# EAGLE design ARE_adaptadora_dsPIC30F4011_44qfn (EAGLE 6.5.0)
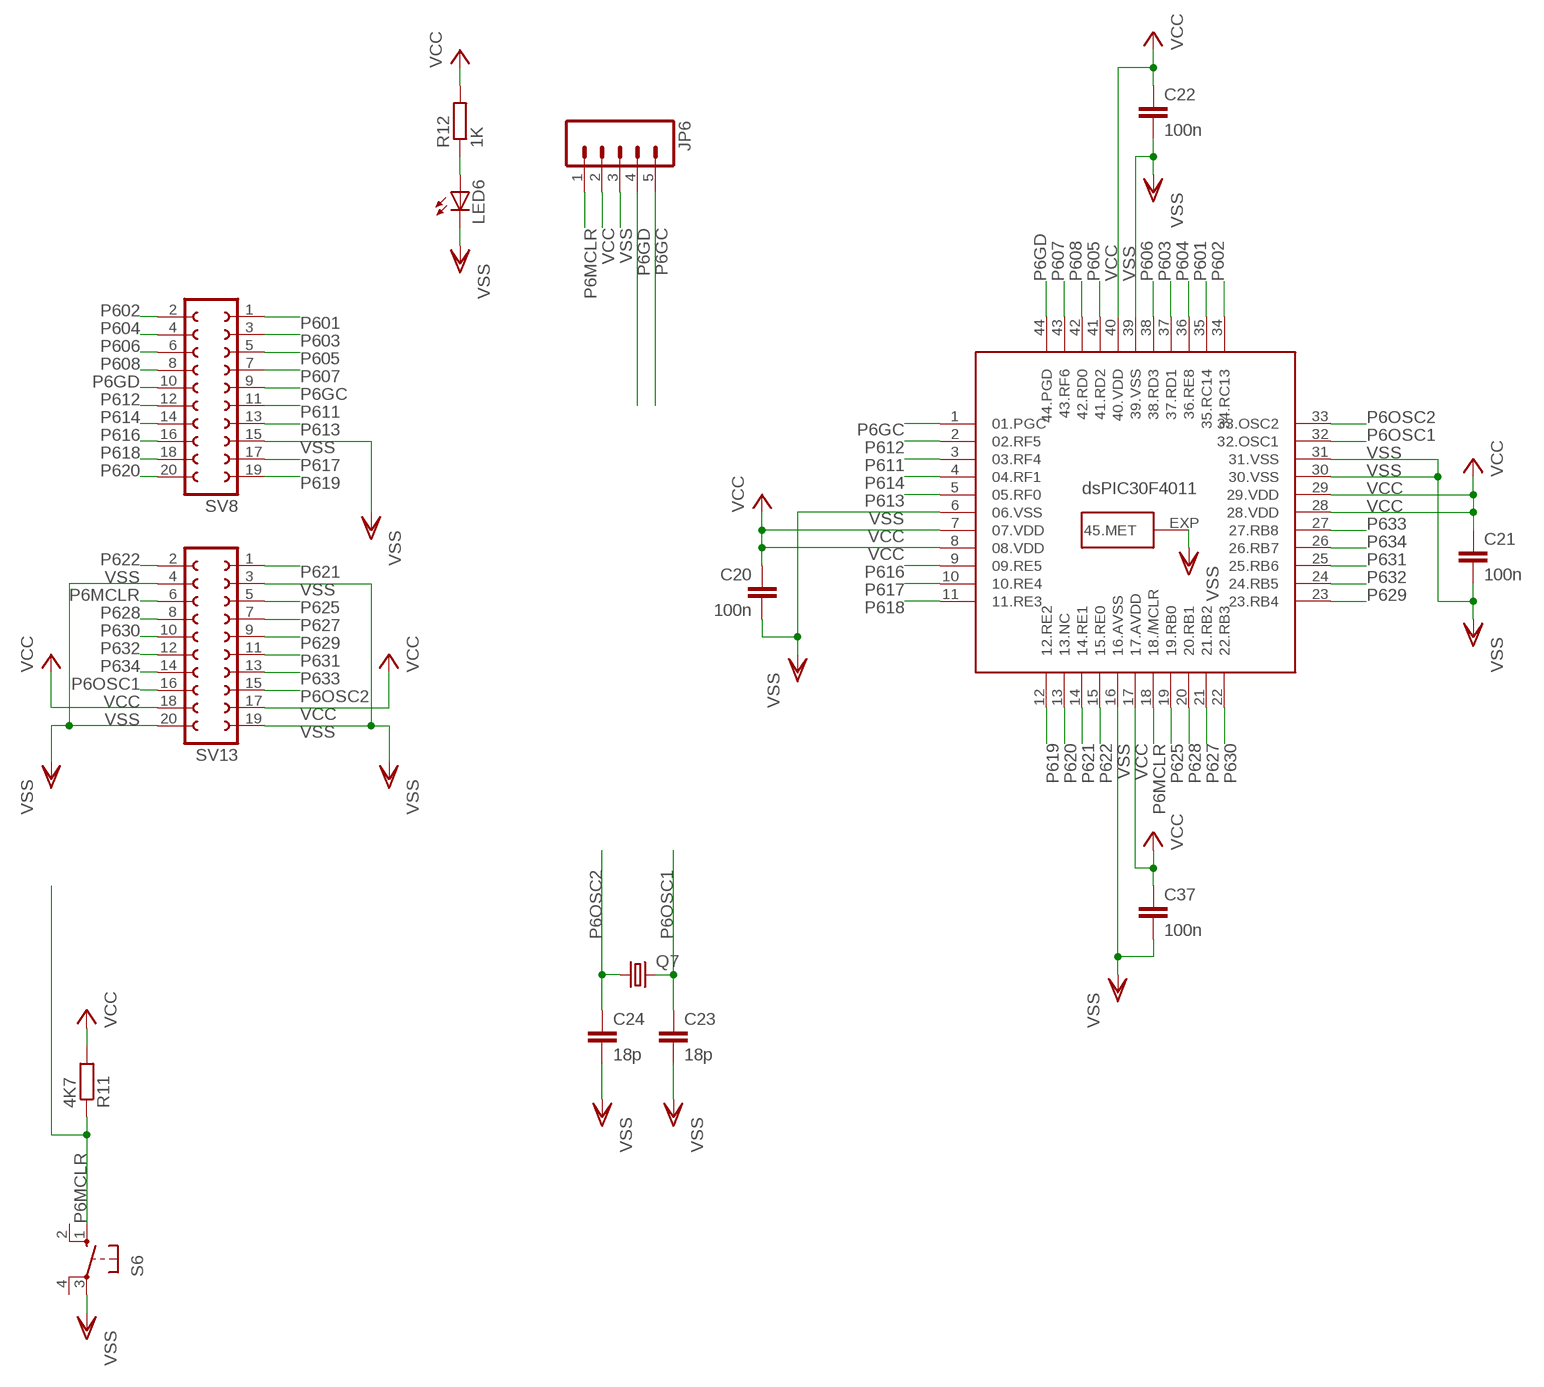
[diagram p0: schematic, sheet 1]

## Parts
C20  100n  C-EUC0805  [C0805]
C21  100n  C-EUC0805  [C0805]
C22  100n  C-EUC0805  [C0805]
C23  18p  C-EUC0805  [C0805]
C24  18p  C-EUC0805  [C0805]
C37  100n  C-EUC0805  [C0805]
JP6  M05PTH  [1X05]
LED6  LEDCHIPLED_0805  [CHIPLED_0805]
Q7  CRYSTALHC18U-V  [HC18U-V]
R11  4K7  R-EU_R0805  [R0805]
R12  1K  R-EU_R0805  [R0805]
S6  10-XX  [B3F-10XX]
SV8  FE10-2W  [FE10-2W]
SV13  FE10-2W  [FE10-2W]
U$2  DSPIC30F4011  [QFN44ML8X8]

## Nets
N$6: LED6.A R12.1
P6GC: JP6.5 SV8.9 U$2.1(01.PGC)
P6GD: JP6.4 SV8.10 U$2.44(44.PGD)
P6MCLR: JP6.1 R11.1 S6.1(S) SV13.6 U$2.18(18./MCLR)
P6OSC1: C23.1 Q7.2 SV13.16 U$2.32(32.OSC1)
P6OSC2: C24.1 Q7.1 SV13.15 U$2.33(33.OSC2)
P601: SV8.1 U$2.35(35.RC14)
P602: SV8.2 U$2.34(34.RC13)
P603: SV8.3 U$2.37(37.RD1)
P604: SV8.4 U$2.36(36.RE8)
P605: SV8.5 U$2.41(41.RD2)
P606: SV8.6 U$2.38(38.RD3)
P607: SV8.7 U$2.43(43.RF6)
P608: SV8.8 U$2.42(42.RD0)
P611: SV8.11 U$2.3(03.RF4)
P612: SV8.12 U$2.2(02.RF5)
P613: SV8.13 U$2.5(05.RF0)
P614: SV8.14 U$2.4(04.RF1)
P616: SV8.16 U$2.9(09.RE5)
P617: SV8.17 U$2.10(10.RE4)
P618: SV8.18 U$2.11(11.RE3)
P619: SV8.19 U$2.12(12.RE2)
P620: SV8.20 U$2.13(13.NC)
P621: SV13.1 U$2.14(14.RE1)
P622: SV13.2 U$2.15(15.RE0)
P625: SV13.5 U$2.19(19.RB0)
P627: SV13.7 U$2.21(21.RB2)
P628: SV13.8 U$2.20(20.RB1)
P629: SV13.9 U$2.23(23.RB4)
P630: SV13.10 U$2.22(22.RB3)
P631: SV13.11 U$2.25(25.RB6)
P632: SV13.12 U$2.24(24.RB5)
P633: SV13.13 U$2.27(27.RB8)
P634: SV13.14 U$2.26(26.RB7)
VCC: C20.1 C21.1 C22.1 C37.1 JP6.2 R11.2 R12.2 SV13.17 SV13.18 U$2.7(07.VDD) U$2.8(08.VDD) U$2.17(17.AVDD) U$2.28(28.VDD) U$2.29(29.VDD) U$2.40(40.VDD)
VSS: C20.2 C21.2 C22.2 C23.2 C24.2 C37.2 JP6.3 LED6.C S6.3(P) SV8.15 SV13.3 SV13.4 SV13.19 SV13.20 U$2.6(06.VSS) U$2.16(16.AVSS) U$2.30(30.VSS) U$2.31(31.VSS) U$2.39(39.VSS) U$2.EXP(45.MET)
Unconnected: S6.2(S1) S6.4(P1)

## Library data of the parts
C20-C24 C37 = rcl:C-EU: CAPACITOR, European symbol
JP6 = SparkFun:M05: Header 5 Standard 5-pin 0.1" header. Use with straight break away headers (SKU : PRT-00116), right angle break away headers (PRT-00553), swiss pins (PRT-00743), machine pins (PRT-00117), and female headers (PRT-00115). Molex polarized connector foot print use with SKU : PRT-08230 with associated crimp pins and housings.
LED6 = led:LED: LED OSRAM: - CHIPLED LG R971, LG N971, LY N971, LG Q971, LY Q971, LO R971, LY R971 LH N974, LH R974 LS Q976, LO Q976, LY Q976 LO Q996 - Hyper CHIPLED LW Q18S LB Q993, LB Q99A, LB R99A - SideLED LS A670, LO A670, LY A670, LG A670, LP A670 LB A673, LV A673, LT A673, LW A673 LH A674 LY A675 LS A676, LA A676, LO A676, LY A676, LW A676 LS A679, LY A679, LG A679 - Hyper Micro SIDELED® LS Y876, LA Y876, LO Y876, LY Y876 LT Y87S - SmartLED LW L88C, LW L88S LB L89C, LB L89S, LG L890 LS L89K, LO L89K, LY L89K LS L896, LA L896, LO L896, LY L896 - TOPLED LS T670, LO T670, LY T670, LG T670, LP T670 LSG T670, LSP T670, LSY T670, LOP T670, LYG T670 LG T671, LOG T671, LSG T671 LB T673, LV T673, LT T673, LW T673 LH T674 LS T676, LA T676, LO T676, LY T676, LB T676, LH T676, LSB T676, LW T676 LB T67C, LV T67C, LT T67C, LS T67K, LO T67K, LY T67K, LW E67C LS E67B, LA E67B, LO E67B, LY E67B, LB E67C, LV E67C, LT E67C LW T67C LS T679, LY T679, LG T679 LS T770, LO T770, LY T770, LG T770, LP T770 LB T773, LV T773, LT T773, LW T773 LH T774 LS E675, LA E675, LY E675, LS T675 LS T776, LA T776, LO T776, LY T776, LB T776 LHGB T686 LT T68C, LB T68C - Hyper Mini TOPLED® LB M676 - Mini TOPLED Santana® LG M470 LS M47K, LO M47K, LY M47K Source: http://www.osram.convergy.de LUXEON: - LUMILED® LXK2-PW12-R00, LXK2-PW12-S00, LXK2-PW14-U00, LXK2-PW14-V00 LXK2-PM12-R00, LXK2-PM12-S00, LXK2-PM14-U00 LXK2-PE12-Q00, LXK2-PE12-R00, LXK2-PE12-S00, LXK2-PE14-T00, LXK2-PE14-U00 LXK2-PB12-K00, LXK2-PB12-L00, LXK2-PB12-M00, LXK2-PB14-N00, LXK2-PB14-P00, LXK2-PB14-Q00 LXK2-PR12-L00, LXK2-PR12-M00, LXK2-PR14-Q00, LXK2-PR14-R00 LXK2-PD12-Q00, LXK2-PD12-R00, LXK2-PD12-S00 LXK2-PH12-R00, LXK2-PH12-S00 LXK2-PL12-P00, LXK2-PL12-Q00, LXK2-PL12-R00 Source: www.luxeon.com KINGBRIGHT: KA-3528ASYC Source: www.kingbright.com
Q7 = crystal:CRYSTAL: CRYSTAL; OC_FARNELL: unknown; OC_NEWARK: unknown
R11 R12 = rcl:R-EU_: RESISTOR, European symbol
S6 = switch-omron:10-XX: OMRON SWITCH; MPN: B3F-1000; OC_FARNELL: 176432; OC_NEWARK: 36M3542
SV8 SV13 = con-lsta:FE10-2W: FEMALE HEADER; OC_FARNELL: unknown; OC_NEWARK: unknown
U$2 = microchip:DSPIC30F4011

## Board
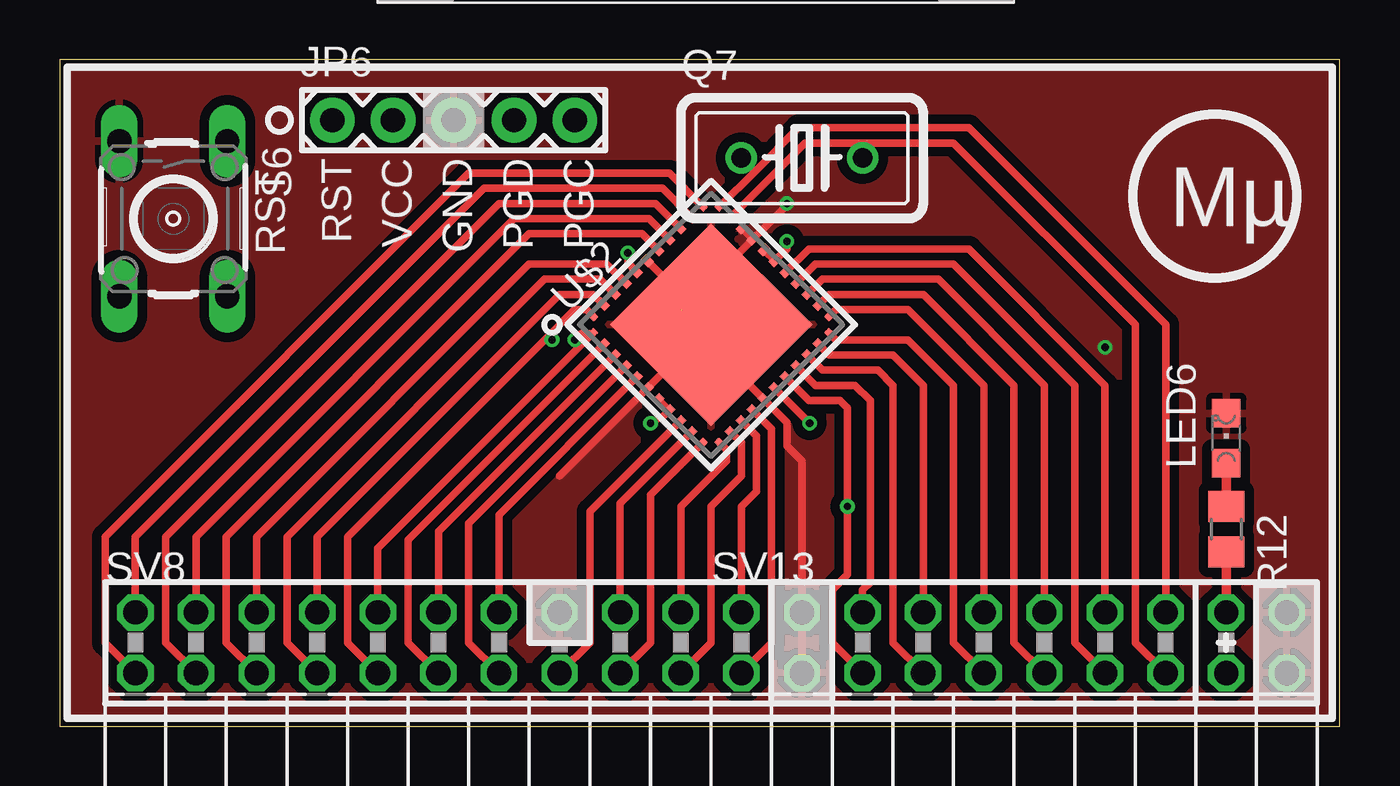
[diagram p1: board, top side]
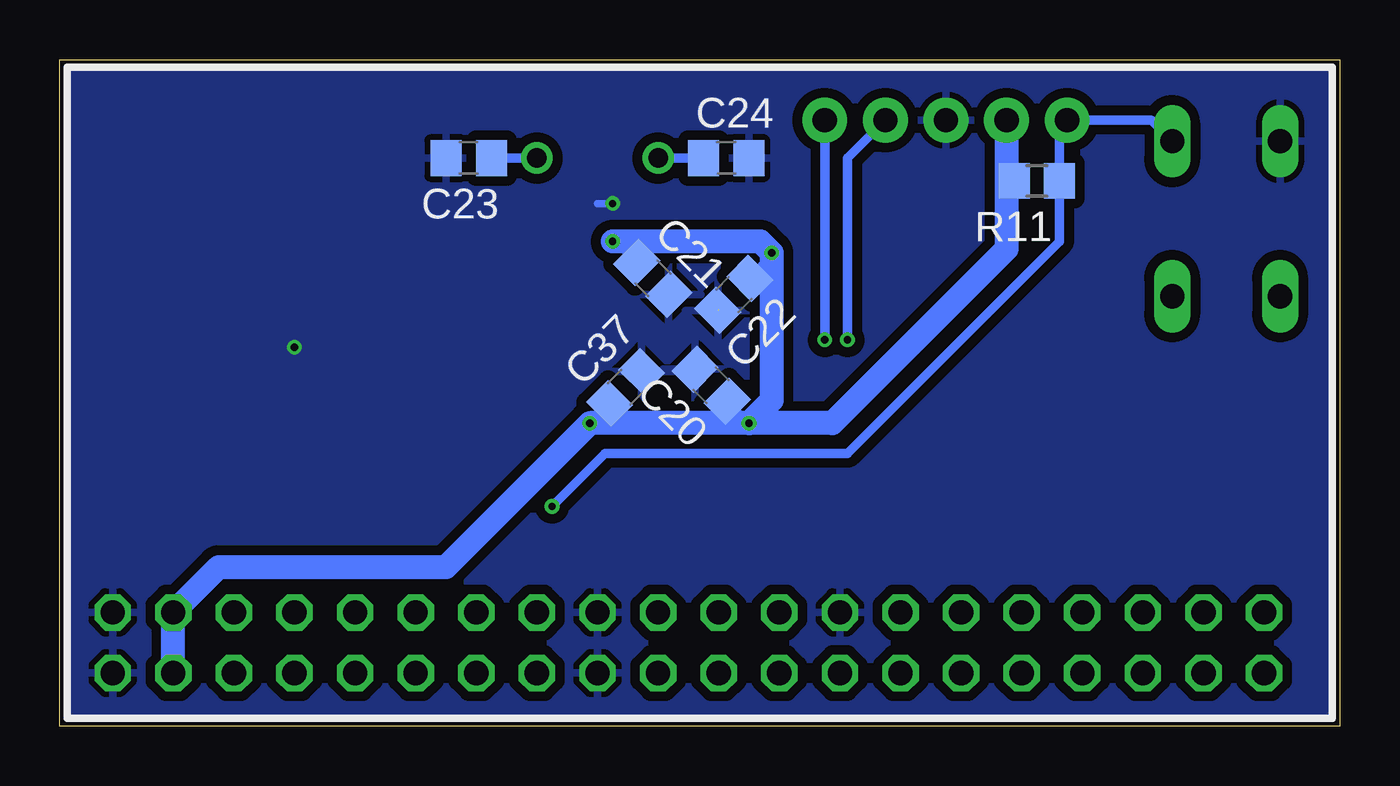
[diagram p2: board, bottom side, seen from below]

Size 53.66 x 27.94 mm. Coordinates in mm from the lower left corner, seen from the top.
Outline: 0,0 53.66,0 53.66,27.94 0,27.94 0,0
Copper layers (1*16): Top 0.035mm / dielectric 1.5mm / Bottom 0.035mm
Design rules "ITEADstudio_DRC": minimum track width 6mil, minimum drill 12mil, track to track 6mil, track to pad 6mil, pad to pad 6mil, via to via 6mil, smd to smd 0mil, copper to edge 10mil, drill to drill 10mil, minimum pad ring 10mil, minimum via ring 6mil, stop-mask expansion 2mil, vias tented up to drill 100mil, thermal gap 10mil

### Footprints (pad centres in the part's own frame; a part is rotated, then mirrored left to right if it is on the bottom)
C0805 = smd 1.3 x 1.5: 1 -0.95,0; 2 0.95,0
1X05 = drill 1.016 pad 1.88: 1 0,0; 2 2.54,0; 3 5.08,0; 4 7.62,0; 5 10.16,0
CHIPLED_0805 = smd 1.2 x 1.2: A 0,-1.05; C 0,1.05
HC18U-V = drill 0.813: 1 -2.54,0; 2 2.54,0
R0805 = smd 1.3 x 1.5: 1 -0.95,0; 2 0.95,0
B3F-10XX = drill 1.016 long: 1 -3.251,2.261; 2 3.251,2.261; 3 -3.251,-2.261; 4 3.251,-2.261
FE10-2W = drill 1.016 octagon: 1 -11.43,1.27; 2 -11.43,-1.27; 3 -8.89,1.27; 4 -8.89,-1.27; 5 -6.35,1.27; 6 -6.35,-1.27; 7 -3.81,1.27; 8 -3.81,-1.27; 9 -1.27,1.27; 10 -1.27,-1.27; 11 1.27,1.27; 12 1.27,-1.27; 13 3.81,1.27; 14 3.81,-1.27; 15 6.35,1.27; 16 6.35,-1.27; 17 8.89,1.27; 18 8.89,-1.27; 19 11.43,1.27; 20 11.43,-1.27
QFN44ML8X8 = smd 0.45 x 0.33: 1 -3.788,3.25; 2 -3.788,2.6; 3 -3.788,1.95; 4 -3.788,1.3; 5 -3.788,0.65; 6 -3.788,0; 7 -3.788,-0.65; 8 -3.788,-1.3; 9 -3.788,-1.95; 10 -3.788,-2.6; 11 -3.788,-3.25; 23 3.788,-3.25; 24 3.788,-2.6; 25 3.788,-1.95; 26 3.788,-1.3; 27 3.788,-0.65; 28 3.788,0; 29 3.788,0.65; 30 3.788,1.3; 31 3.788,1.95; 32 3.788,2.6; 33 3.788,3.25 | smd 0.33 x 0.45: 12 -3.25,-3.788; 13 -2.6,-3.788; 14 -1.95,-3.788; 15 -1.3,-3.788; 16 -0.65,-3.788; 17 0,-3.788; 18 0.65,-3.788; 19 1.3,-3.788; 20 1.95,-3.788; 21 2.6,-3.788; 22 3.25,-3.788; 34 3.25,3.788; 35 2.6,3.788; 36 1.95,3.788; 37 1.3,3.788; 38 0.65,3.788; 39 0,3.788; 40 -0.65,3.788; 41 -1.3,3.788; 42 -1.95,3.788; 43 -2.6,3.788; 44 -3.25,3.788 | smd 6 x 6: EXP 0,0

### Placement (x,y rotation side)
C20  26.35,14.29 135 bottom
C21  28.8,18.77 315 bottom
C22  25.4,18.1 225 bottom
C23  36.51,23.81 180 bottom
C24  25.72,23.81 0 bottom
C37  29.94,14.19 45 bottom
JP6  11.43,25.4 0 top
LED6  48.89,12.06 0 top
Q7  31.11,23.81 0 top
R11  12.7,22.86 180 bottom
R12  48.89,8.25 270 top
S6  4.76,21.27 270 top
SV8  14.6,3.49 0 top
SV13  40.01,3.49 0 top
U$2  27.3,16.83 45 top

### Tracks (layer width: path | path; a pad name or v marks a point on that pad's centre or on a via)
N$6
  Top 0.406: R12.1 LED6.A
P6GC  (via drill 0.3 pad 0.61)
  Top 0.305: SV8.9 13.33,7.45 U$2.1 21.84,16.45 v21.59,16.19
  Bottom 0.406: JP6.5 v21.59,16.19
P6GD  (via drill 0.3 pad 0.61)
  Top 0.305: U$2.44 22.07,17.46 21.59,17.46 20.32,16.19 | 20.32,16.19 12.07,7.94 12.07,3.49 SV8.10 | v20.64,16.19 20.32,16.19
  Bottom 0.406: JP6.4 20.64,23.81 v20.64,16.19
P6MCLR  (via drill 0.3 pad 0.61)
  Top 0.305: SV13.6 32.39,3.49 32.39,5.71 33.02,6.35 v33.02,9.21 33.02,13.34 32.7,13.65 31.4,13.65 U$2.18
  Bottom 0.305: JP6.1 11.75,25.08 | R11.1
  Bottom 0.406: 11.75,25.08 R11.1 11.75,20.32 20.64,11.43 30.8,11.43 v33.02,9.21 | S6.1 7.9,25.4 JP6.1
P6OSC1
  Top 0.305: U$2.32 31.25,24.45 33.65,24.45 | 33.65,24.45 37.46,24.45 45.08,16.83 45.08,3.49 SV13.16 | Q7.2 33.65,24.45
  Bottom 0.406: C23.1 Q7.2
P6OSC2
  Top 0.305: U$2.33 29.13,23.25 | 29.13,23.25 30.96,25.08 38.1,25.08 46.36,16.83 SV13.15 | Q7.1 29.13,23.25 | 29.13,23.25
  Bottom 0.406: C24.1 Q7.1
P601
  Top 0.305: U$2.35 25.27,22.54 17.78,22.54 3.18,7.94 SV8.1
P602
  Top 0.305: U$2.34 25.55,23.18 17.14,23.18 1.91,7.94 1.91,3.49 SV8.2
P603
  Top 0.305: U$2.37 24.7,21.27 19.05,21.27 5.71,7.94 SV8.3
P604
  Top 0.305: U$2.36 24.98,21.91 18.41,21.91 4.44,7.94 4.44,3.49 SV8.4
P605
  Top 0.305: U$2.41 22.93,19.37 19.69,19.37 8.25,7.94 SV8.5
P606
  Top 0.305: U$2.38 24.41,20.64 19.69,20.64 6.99,7.94 6.99,3.49 SV8.6
P607
  Top 0.305: U$2.43 22.36,18.1 20.96,18.1 10.8,7.94 SV8.7
P608
  Top 0.305: U$2.42 22.64,18.73 20.32,18.73 9.52,7.94 9.52,3.49 SV8.8
P611
  Top 0.305: U$2.3 15.88,8.16 SV8.11
P612
  Top 0.305: U$2.2 14.6,7.8 14.6,3.49 SV8.12
P613
  Top 0.305: U$2.5 18.41,8.86 SV8.13
P614
  Top 0.305: U$2.4 17.14,8.51 17.14,3.49 SV8.14
P616
  Top 0.305: U$2.9 22.22,8.99 22.22,3.49 SV8.16
P617
  Top 0.305: U$2.10 23.49,9.34 SV8.17
P618
  Top 0.305: U$2.11 24.77,9.69 24.77,3.49 SV8.18
P619
  Top 0.305: U$2.12 27.94,11.6 27.94,11.11 26.04,9.21 SV8.19
P620
  Top 0.305: U$2.13 28.58,11.88 28.58,10.48 27.3,9.21 27.3,3.49 SV8.20
P621
  Top 0.305: U$2.14 29.21,12.16 29.21,9.84 28.58,9.21 SV13.1
P622
  Top 0.305: U$2.15 29.84,12.45 29.84,3.49 SV13.2
P625
  Top 0.305: SV13.5 33.65,5.71 33.97,6.03 33.97,13.65 33.34,14.29 31.68,14.29 U$2.19
P627
  Top 0.305: SV13.7 36.2,14.29 34.93,15.56 32.25,15.56 U$2.21
P628
  Top 0.305: SV13.8 34.93,3.49 34.93,14.29 34.29,14.92 31.97,14.92 U$2.20
P629
  Top 0.305: U$2.23 32.54,17.46 35.56,17.46 38.74,14.29 SV13.9
P630
  Top 0.305: SV13.10 37.46,3.49 37.46,14.29 35.56,16.19 32.54,16.19 U$2.22
P631
  Top 0.305: U$2.25 31.97,18.73 36.83,18.73 41.27,14.29 SV13.11
P632
  Top 0.305: U$2.24 32.25,18.1 36.2,18.1 40.01,14.29 40.01,3.49 SV13.12
P633
  Top 0.305: U$2.27 31.4,20 38.1,20 43.81,14.29 SV13.13
P634
  Top 0.305: U$2.26 31.68,19.37 37.46,19.37 42.55,14.29 42.55,3.49 SV13.14
VCC  (via drill 0.3 pad 0.61)
  Top 0.305: U$2.7 U$2.8 25.33,13.02 v24.77,12.7 | U$2.29 U$2.28 30.48,20 v30.48,20.32 | U$2.17 v31.43,12.7 | U$2.40 23.81,19.4 v23.81,19.84
  Top 0.406: R12.2 SV13.17
  Bottom 0.305: 31.11,13.02 v31.43,12.7 C37.1 | C20.1 v24.77,12.7 | C21.1 30.35,20.32 v30.48,20.32 | C22.1 v23.81,19.84 | R11.2 13.97,22.86
  Bottom 1.016: SV13.18 SV13.17 46.99,6.67 37.46,6.67 v31.43,12.7 v24.77,12.7 | v24.77,12.7 23.81,13.65 v23.81,19.84 24.29,20.32 v30.48,20.32 | JP6.2 13.97,22.86 13.97,20 21.27,12.7 v24.77,12.7
VSS  (via drill 0.3 pad 0.61)  (1 unrouted)
  Top 0.305: SV13.4 SV13.3 31.11,11.11 30.48,11.75 30.48,12.73 U$2.16 28.58,14.64 28.58,14.92 | U$2.31 U$2.30 | 20.96,10.48 U$2.6 25.4,14.92 | 28.01,19.37 28.01,18.16 27.94,18.1 | v30.48,21.91 30.48,21.84 U$2.30 | U$2.39 26.04,18.1 26.04,17.46 | U$2.30 28.01,19.37 | 28.01,19.37 27.94,19.37
  Bottom 0.305: v30.48,21.91 31.11,21.91
  other vias: 43.81,15.88
  pour Top (isolate 0.406): 0.32,0.32 53.34,0.32 53.34,27.62 0.32,27.62
  pour Bottom (isolate 0.406): 0.32,0.32 53.34,0.32 53.34,27.62 0.32,27.62

### Text on the board
_tsilk: CC by nc sa | dragonet80 - 2013 | RST | RST | VCC | GND | PGD | PGC | Mµ